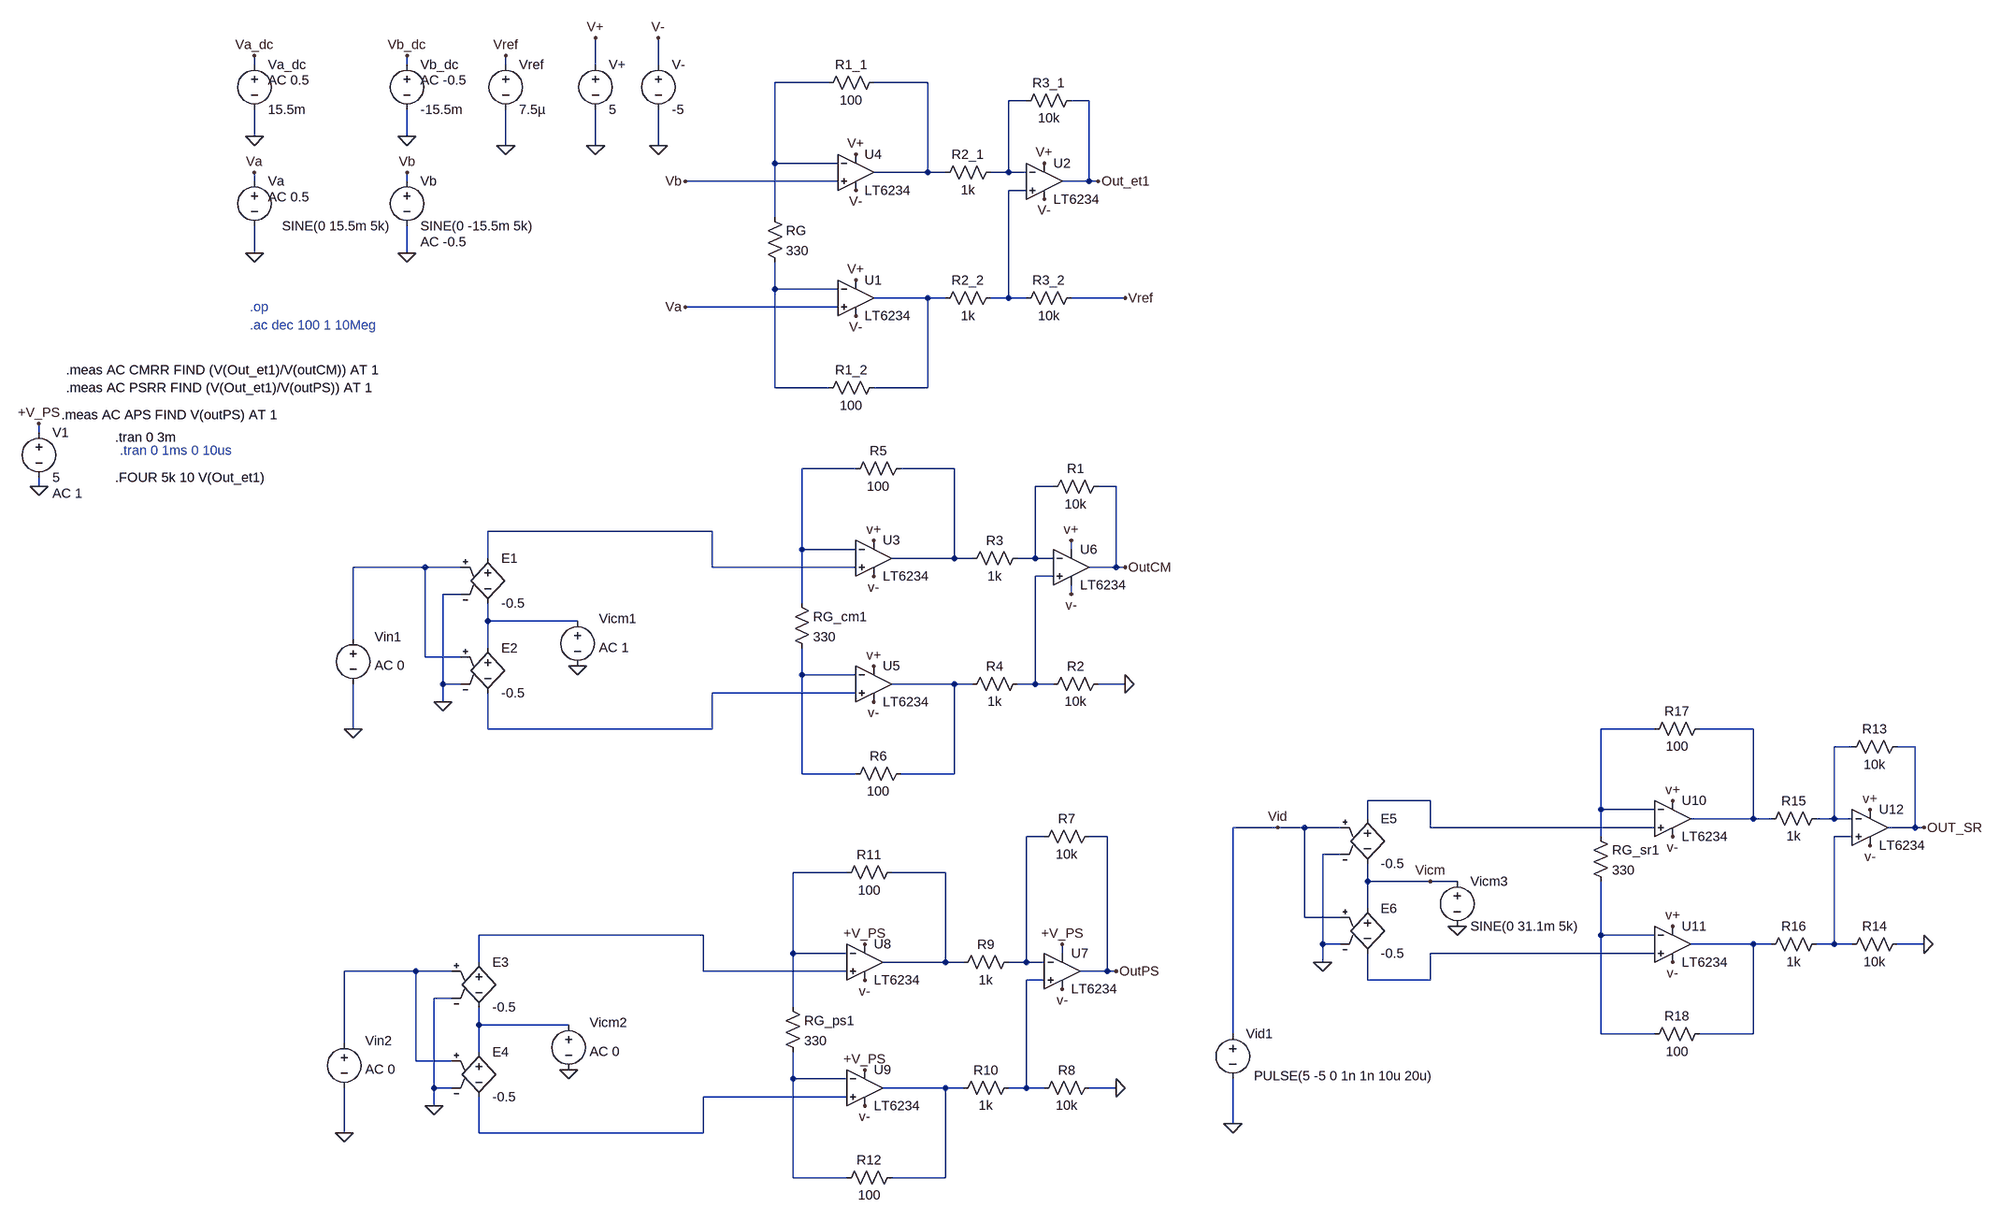
[diagram p0: schematic etaj1.asc]
etaj1.asc, the LTspice schematic file:
Version 4
SHEET 1 2128 1792
WIRE -960 -240 -960 -256
WIRE -688 -240 -688 -256
WIRE -512 -240 -512 -256
WIRE -352 -240 -352 -288
WIRE -240 -240 -240 -288
WIRE 64 -208 -32 -208
WIRE 240 -208 144 -208
WIRE 416 -176 384 -176
WIRE 528 -176 496 -176
WIRE -960 -112 -960 -160
WIRE -688 -112 -688 -160
WIRE -512 -96 -512 -160
WIRE -352 -96 -352 -160
WIRE -240 -96 -240 -160
WIRE -32 -64 -32 -208
WIRE 80 -64 -32 -64
WIRE 240 -48 240 -208
WIRE 240 -48 144 -48
WIRE 272 -48 240 -48
WIRE 384 -48 384 -176
WIRE 384 -48 352 -48
WIRE 416 -48 384 -48
WIRE -960 -32 -960 -48
WIRE -688 -32 -688 -48
WIRE 80 -32 -192 -32
WIRE 528 -32 528 -176
WIRE 528 -32 480 -32
WIRE 544 -32 528 -32
WIRE 416 -16 384 -16
WIRE -32 32 -32 -64
WIRE -960 96 -960 48
WIRE -688 96 -688 48
WIRE -32 160 -32 112
WIRE 80 160 -32 160
WIRE 240 176 144 176
WIRE 272 176 240 176
WIRE 384 176 384 -16
WIRE 384 176 352 176
WIRE 416 176 384 176
WIRE 592 176 496 176
WIRE 80 192 -192 192
WIRE -32 336 -32 160
WIRE 64 336 -32 336
WIRE 240 336 240 176
WIRE 240 336 144 336
WIRE -1344 416 -1344 400
WIRE 112 480 16 480
WIRE 288 480 192 480
WIRE -1344 512 -1344 496
WIRE 464 512 432 512
WIRE 576 512 544 512
WIRE -144 592 -544 592
WIRE 16 624 16 480
WIRE 112 624 16 624
WIRE 496 624 496 608
WIRE -544 640 -544 592
WIRE 288 640 288 480
WIRE 288 640 176 640
WIRE 320 640 288 640
WIRE 432 640 432 512
WIRE 432 640 400 640
WIRE 464 640 432 640
WIRE -656 656 -784 656
WIRE -592 656 -656 656
WIRE -144 656 -144 592
WIRE 112 656 -144 656
WIRE 576 656 576 512
WIRE 576 656 528 656
WIRE 592 656 576 656
WIRE 464 672 432 672
WIRE -592 704 -624 704
WIRE 496 704 496 688
WIRE 16 720 16 624
WIRE -544 752 -544 720
WIRE -384 752 -544 752
WIRE -784 784 -784 656
WIRE -544 800 -544 752
WIRE -656 816 -656 656
WIRE -592 816 -656 816
WIRE 16 848 16 800
WIRE 112 848 16 848
WIRE -624 864 -624 704
WIRE -592 864 -624 864
WIRE 288 864 176 864
WIRE 320 864 288 864
WIRE 432 864 432 672
WIRE 432 864 400 864
WIRE 464 864 432 864
WIRE 592 864 544 864
WIRE 112 880 -144 880
WIRE -624 896 -624 864
WIRE -784 944 -784 864
WIRE -544 944 -544 880
WIRE -144 944 -144 880
WIRE -144 944 -544 944
WIRE 1536 944 1440 944
WIRE 1712 944 1616 944
WIRE 1888 976 1856 976
WIRE 2000 976 1968 976
WIRE 16 1024 16 848
WIRE 112 1024 16 1024
WIRE 288 1024 288 864
WIRE 288 1024 192 1024
WIRE 1136 1072 1024 1072
WIRE 1440 1088 1440 944
WIRE 1536 1088 1440 1088
WIRE 1024 1104 1024 1072
WIRE 1712 1104 1712 944
WIRE 1712 1104 1600 1104
WIRE 1744 1104 1712 1104
WIRE 1856 1104 1856 976
WIRE 1856 1104 1824 1104
WIRE 1888 1104 1856 1104
WIRE 864 1120 784 1120
WIRE 912 1120 864 1120
WIRE 976 1120 912 1120
WIRE 1136 1120 1136 1072
WIRE 1536 1120 1136 1120
WIRE 2000 1120 2000 976
WIRE 2000 1120 1952 1120
WIRE 2016 1120 2000 1120
WIRE 448 1136 416 1136
WIRE 560 1136 528 1136
WIRE 1440 1136 1440 1088
WIRE 1888 1136 1856 1136
WIRE 976 1168 944 1168
WIRE 96 1200 0 1200
WIRE 272 1200 176 1200
WIRE 1024 1216 1024 1184
WIRE 1136 1216 1024 1216
WIRE 1184 1216 1136 1216
WIRE 1024 1264 1024 1216
WIRE 912 1280 912 1120
WIRE 976 1280 912 1280
WIRE -160 1312 -560 1312
WIRE 1440 1312 1440 1216
WIRE 1536 1312 1440 1312
WIRE 944 1328 944 1168
WIRE 976 1328 944 1328
WIRE 1712 1328 1600 1328
WIRE 1744 1328 1712 1328
WIRE 1856 1328 1856 1136
WIRE 1856 1328 1824 1328
WIRE 1888 1328 1856 1328
WIRE 2016 1328 1968 1328
WIRE 0 1344 0 1200
WIRE 96 1344 0 1344
WIRE 480 1344 480 1328
WIRE 1536 1344 1136 1344
WIRE -560 1360 -560 1312
WIRE 272 1360 272 1200
WIRE 272 1360 160 1360
WIRE 304 1360 272 1360
WIRE 416 1360 416 1136
WIRE 416 1360 384 1360
WIRE 448 1360 416 1360
WIRE 944 1360 944 1328
WIRE -672 1376 -800 1376
WIRE -608 1376 -672 1376
WIRE -160 1376 -160 1312
WIRE 96 1376 -160 1376
WIRE 560 1376 560 1136
WIRE 560 1376 512 1376
WIRE 576 1376 560 1376
WIRE 448 1392 416 1392
WIRE 1024 1392 1024 1344
WIRE 1136 1392 1136 1344
WIRE 1136 1392 1024 1392
WIRE -608 1424 -640 1424
WIRE 0 1440 0 1344
WIRE -560 1472 -560 1440
WIRE -400 1472 -560 1472
WIRE 784 1488 784 1120
WIRE 1440 1488 1440 1312
WIRE 1536 1488 1440 1488
WIRE 1712 1488 1712 1328
WIRE 1712 1488 1616 1488
WIRE -800 1504 -800 1376
WIRE -560 1520 -560 1472
WIRE -672 1536 -672 1376
WIRE -608 1536 -672 1536
WIRE 0 1568 0 1520
WIRE 96 1568 0 1568
WIRE -640 1584 -640 1424
WIRE -608 1584 -640 1584
WIRE 272 1584 160 1584
WIRE 304 1584 272 1584
WIRE 416 1584 416 1392
WIRE 416 1584 384 1584
WIRE 448 1584 416 1584
WIRE 576 1584 528 1584
WIRE 96 1600 -160 1600
WIRE -640 1616 -640 1584
WIRE 784 1648 784 1568
WIRE -800 1664 -800 1584
WIRE -560 1664 -560 1600
WIRE -160 1664 -160 1600
WIRE -160 1664 -560 1664
WIRE 0 1744 0 1568
WIRE 96 1744 0 1744
WIRE 272 1744 272 1584
WIRE 272 1744 176 1744
FLAG 544 -32 Out_et1
FLAG -352 -96 0
FLAG -240 -96 0
FLAG -352 -288 V+
FLAG -240 -288 V-
FLAG 112 -80 V+
FLAG 112 208 V-
FLAG 112 -16 V-
FLAG 112 144 V+
FLAG 448 0 V-
FLAG 448 -64 V+
FLAG -960 -112 0
FLAG -960 96 0
FLAG -688 -112 0
FLAG -688 96 0
FLAG -960 -256 Va_dc
FLAG -960 -48 Va
FLAG -688 -256 Vb_dc
FLAG -688 -48 Vb
FLAG -512 -96 0
FLAG -512 -256 Vref
FLAG 592 176 Vref
FLAG -192 -32 Vb
FLAG -192 192 Va
FLAG 592 864 0
FLAG 592 656 OutCM
FLAG 496 608 v+
FLAG 496 704 v-
FLAG -784 944 0
FLAG -624 896 0
FLAG -384 832 0
FLAG 576 1584 0
FLAG 576 1376 OutPS
FLAG -800 1664 0
FLAG -640 1616 0
FLAG -400 1552 0
FLAG 480 1328 +V_PS
FLAG 144 608 v+
FLAG 144 672 v-
FLAG 144 896 v-
FLAG 144 832 v+
FLAG 128 1616 v-
FLAG 480 1408 v-
FLAG 128 1392 v-
FLAG 128 1328 +V_PS
FLAG 128 1552 +V_PS
FLAG 2016 1328 0
FLAG 2016 1120 OUT_SR
FLAG 784 1648 0
FLAG 944 1360 0
FLAG 1184 1296 0
FLAG 864 1120 Vid
FLAG 1136 1216 Vicm
FLAG 1568 1072 v+
FLAG 1568 1136 v-
FLAG 1568 1296 v+
FLAG 1568 1360 v-
FLAG 1920 1088 v+
FLAG 1920 1152 v-
FLAG -1344 512 0
FLAG -1344 400 +V_PS
SYMBOL res 512 -192 R90
WINDOW 0 0 56 VBottom 2
WINDOW 3 32 56 VTop 2
SYMATTR InstName R3_1
SYMATTR Value 10k
SYMATTR SpiceLine tol=1 pwr=0.1
SYMBOL res 512 160 R90
WINDOW 0 0 56 VBottom 2
WINDOW 3 32 56 VTop 2
SYMATTR InstName R3_2
SYMATTR Value 10k
SYMATTR SpiceLine tol=1 pwr=0.1
SYMBOL res 368 -64 R90
WINDOW 0 0 56 VBottom 2
WINDOW 3 32 56 VTop 2
SYMATTR InstName R2_1
SYMATTR Value 1k
SYMATTR SpiceLine tol=1 pwr=0.1
SYMBOL res 368 160 R90
WINDOW 0 0 56 VBottom 2
WINDOW 3 32 56 VTop 2
SYMATTR InstName R2_2
SYMATTR Value 1k
SYMATTR SpiceLine tol=1 pwr=0.1
SYMBOL res -48 16 R0
SYMATTR InstName RG
SYMATTR Value 330
SYMATTR SpiceLine tol=1 pwr=0.1
SYMBOL res 160 -224 R90
WINDOW 0 0 56 VBottom 2
WINDOW 3 32 56 VTop 2
SYMATTR InstName R1_1
SYMATTR Value 100
SYMATTR SpiceLine tol=1 pwr=0.1
SYMBOL res 160 320 R90
WINDOW 0 0 56 VBottom 2
WINDOW 3 32 56 VTop 2
SYMATTR InstName R1_2
SYMATTR Value 100
SYMATTR SpiceLine tol=1 pwr=0.1
SYMBOL OpAmps\\LT6234 112 -48 R0
SYMATTR InstName U4
SYMBOL OpAmps\\LT6234 112 176 R0
SYMATTR InstName U1
SYMBOL OpAmps\\LT6234 448 -32 R0
SYMATTR InstName U2
SYMBOL voltage -352 -256 R0
SYMATTR InstName V+
SYMATTR Value 5
SYMBOL voltage -240 -256 R0
WINDOW 123 0 0 Left 0
WINDOW 39 0 0 Left 0
SYMATTR InstName V-
SYMATTR Value -5
SYMBOL voltage -688 -48 R0
WINDOW 123 24 124 Left 2
WINDOW 39 0 0 Left 0
SYMATTR Value2 AC -0.5
SYMATTR InstName Vb
SYMATTR Value SINE(0 -15.5m 5k)
SYMBOL voltage -688 -256 R0
WINDOW 123 24 44 Left 2
WINDOW 39 0 0 Left 0
SYMATTR Value2 AC -0.5
SYMATTR InstName Vb_dc
SYMATTR Value -15.5m
SYMBOL voltage -960 -48 R0
WINDOW 3 241 96 Right 2
WINDOW 123 24 44 Left 2
WINDOW 39 0 0 Left 0
SYMATTR Value SINE(0 15.5m 5k)
SYMATTR Value2 AC 0.5
SYMATTR InstName Va
SYMBOL voltage -960 -256 R0
WINDOW 123 24 44 Left 2
WINDOW 39 0 0 Left 0
SYMATTR Value2 AC 0.5
SYMATTR InstName Va_dc
SYMATTR Value 15.5m
SYMBOL voltage -512 -256 R0
WINDOW 123 0 0 Left 0
WINDOW 39 0 0 Left 0
SYMATTR InstName Vref
SYMATTR Value 7.5µ
SYMBOL res 560 496 R90
WINDOW 0 0 56 VBottom 2
WINDOW 3 32 56 VTop 2
SYMATTR InstName R1
SYMATTR Value 10k
SYMATTR SpiceLine tol=1 pwr=0.1
SYMBOL res 560 848 R90
WINDOW 0 0 56 VBottom 2
WINDOW 3 32 56 VTop 2
SYMATTR InstName R2
SYMATTR Value 10k
SYMATTR SpiceLine tol=1 pwr=0.1
SYMBOL res 416 624 R90
WINDOW 0 0 56 VBottom 2
WINDOW 3 32 56 VTop 2
SYMATTR InstName R3
SYMATTR Value 1k
SYMATTR SpiceLine tol=1 pwr=0.1
SYMBOL res 416 848 R90
WINDOW 0 0 56 VBottom 2
WINDOW 3 32 56 VTop 2
SYMATTR InstName R4
SYMATTR Value 1k
SYMATTR SpiceLine tol=1 pwr=0.1
SYMBOL res 0 704 R0
SYMATTR InstName RG_cm1
SYMATTR Value 330
SYMATTR SpiceLine tol=1 pwr=0.1
SYMBOL res 208 464 R90
WINDOW 0 0 56 VBottom 2
WINDOW 3 32 56 VTop 2
SYMATTR InstName R5
SYMATTR Value 100
SYMATTR SpiceLine tol=1 pwr=0.1
SYMBOL res 208 1008 R90
WINDOW 0 0 56 VBottom 2
WINDOW 3 32 56 VTop 2
SYMATTR InstName R6
SYMATTR Value 100
SYMATTR SpiceLine tol=1 pwr=0.1
SYMBOL voltage -784 768 R0
WINDOW 123 38 63 Left 2
WINDOW 39 0 0 Left 2
WINDOW 0 38 12 Left 2
WINDOW 3 38 40 Left 2
SYMATTR Value2 AC 0
SYMATTR InstName Vin1
SYMATTR Value ""
SYMBOL e -544 624 R0
SYMATTR InstName E1
SYMATTR Value -0.5
SYMBOL e -544 784 R0
SYMATTR InstName E2
SYMATTR Value -0.5
SYMBOL voltage -384 736 R0
WINDOW 123 38 63 Left 2
WINDOW 39 0 0 Left 2
WINDOW 0 38 12 Left 2
WINDOW 3 -188 38 Left 2
SYMATTR Value2 AC 1
SYMATTR InstName Vicm1
SYMATTR Value ""
SYMBOL res 544 1120 R90
WINDOW 0 0 56 VBottom 2
WINDOW 3 32 56 VTop 2
SYMATTR InstName R7
SYMATTR Value 10k
SYMATTR SpiceLine tol=1 pwr=0.1
SYMBOL res 544 1568 R90
WINDOW 0 0 56 VBottom 2
WINDOW 3 32 56 VTop 2
SYMATTR InstName R8
SYMATTR Value 10k
SYMATTR SpiceLine tol=1 pwr=0.1
SYMBOL res 400 1344 R90
WINDOW 0 0 56 VBottom 2
WINDOW 3 32 56 VTop 2
SYMATTR InstName R9
SYMATTR Value 1k
SYMATTR SpiceLine tol=1 pwr=0.1
SYMBOL res 400 1568 R90
WINDOW 0 0 56 VBottom 2
WINDOW 3 32 56 VTop 2
SYMATTR InstName R10
SYMATTR Value 1k
SYMATTR SpiceLine tol=1 pwr=0.1
SYMBOL res -16 1424 R0
SYMATTR InstName RG_ps1
SYMATTR Value 330
SYMATTR SpiceLine tol=1 pwr=0.1
SYMBOL res 192 1184 R90
WINDOW 0 0 56 VBottom 2
WINDOW 3 32 56 VTop 2
SYMATTR InstName R11
SYMATTR Value 100
SYMATTR SpiceLine tol=1 pwr=0.1
SYMBOL res 192 1728 R90
WINDOW 0 0 56 VBottom 2
WINDOW 3 32 56 VTop 2
SYMATTR InstName R12
SYMATTR Value 100
SYMATTR SpiceLine tol=1 pwr=0.1
SYMBOL voltage -800 1488 R0
WINDOW 123 38 63 Left 2
WINDOW 39 0 0 Left 2
WINDOW 0 38 12 Left 2
WINDOW 3 38 40 Left 2
SYMATTR Value2 AC 0
SYMATTR InstName Vin2
SYMATTR Value ""
SYMBOL e -560 1344 R0
SYMATTR InstName E3
SYMATTR Value -0.5
SYMBOL e -560 1504 R0
SYMATTR InstName E4
SYMATTR Value -0.5
SYMBOL voltage -400 1456 R0
WINDOW 123 38 63 Left 2
WINDOW 39 0 0 Left 2
WINDOW 0 38 12 Left 2
WINDOW 3 -188 38 Left 2
SYMATTR Value2 AC 0
SYMATTR InstName Vicm2
SYMATTR Value ""
SYMBOL OpAmps\\LT6234 144 640 R0
SYMATTR InstName U3
SYMBOL OpAmps\\LT6234 144 864 R0
SYMATTR InstName U5
SYMBOL OpAmps\\LT6234 496 656 R0
SYMATTR InstName U6
SYMBOL OpAmps\\LT6234 480 1376 R0
SYMATTR InstName U7
SYMBOL OpAmps\\LT6234 128 1360 R0
SYMATTR InstName U8
SYMBOL OpAmps\\LT6234 128 1584 R0
SYMATTR InstName U9
SYMBOL res 1984 960 R90
WINDOW 0 0 56 VBottom 2
WINDOW 3 32 56 VTop 2
SYMATTR InstName R13
SYMATTR Value 10k
SYMATTR SpiceLine tol=1 pwr=0.1
SYMBOL res 1984 1312 R90
WINDOW 0 0 56 VBottom 2
WINDOW 3 32 56 VTop 2
SYMATTR InstName R14
SYMATTR Value 10k
SYMATTR SpiceLine tol=1 pwr=0.1
SYMBOL res 1840 1088 R90
WINDOW 0 0 56 VBottom 2
WINDOW 3 32 56 VTop 2
SYMATTR InstName R15
SYMATTR Value 1k
SYMATTR SpiceLine tol=1 pwr=0.1
SYMBOL res 1840 1312 R90
WINDOW 0 0 56 VBottom 2
WINDOW 3 32 56 VTop 2
SYMATTR InstName R16
SYMATTR Value 1k
SYMATTR SpiceLine tol=1 pwr=0.1
SYMBOL res 1424 1120 R0
SYMATTR InstName RG_sr1
SYMATTR Value 330
SYMATTR SpiceLine tol=1 pwr=0.1
SYMBOL res 1632 928 R90
WINDOW 0 0 56 VBottom 2
WINDOW 3 32 56 VTop 2
SYMATTR InstName R17
SYMATTR Value 100
SYMATTR SpiceLine tol=1 pwr=0.1
SYMBOL res 1632 1472 R90
WINDOW 0 0 56 VBottom 2
WINDOW 3 32 56 VTop 2
SYMATTR InstName R18
SYMATTR Value 100
SYMATTR SpiceLine tol=1 pwr=0.1
SYMBOL e 1024 1088 R0
SYMATTR InstName E5
SYMATTR Value -0.5
SYMBOL e 1024 1248 R0
SYMATTR InstName E6
SYMATTR Value -0.5
SYMBOL voltage 1184 1200 R0
WINDOW 123 0 0 Left 0
WINDOW 39 0 0 Left 0
SYMATTR InstName Vicm3
SYMATTR Value SINE(0 31.1m 5k)
SYMBOL voltage 784 1472 R0
WINDOW 123 0 0 Left 2
WINDOW 39 0 0 Left 2
WINDOW 3 38 91 Left 2
SYMATTR Value PULSE(5 -5 0 1n 1n 10u 20u)
SYMATTR InstName Vid1
SYMBOL OpAmps\\LT6234 1568 1104 R0
SYMATTR InstName U10
SYMBOL OpAmps\\LT6234 1568 1328 R0
SYMATTR InstName U11
SYMBOL OpAmps\\LT6234 1920 1120 R0
SYMATTR InstName U12
SYMBOL voltage -1344 400 R0
WINDOW 123 24 124 Left 2
WINDOW 39 0 0 Left 2
SYMATTR Value2 AC 1
SYMATTR InstName V1
SYMATTR Value 5
TEXT -968 192 Left 2 ;.op
TEXT -968 224 Left 2 ;.ac dec 100 1 10Meg
TEXT -1296 304 Left 2 !.meas AC CMRR FIND (V(Out_et1)/V(outCM)) AT 1
TEXT -1296 336 Left 2 !.meas AC PSRR FIND (V(Out_et1)/V(outPS)) AT 1
TEXT -1304 384 Left 2 !.meas AC APS FIND V(outPS) AT 1
TEXT -1208 424 Left 2 !.tran 0 3m
TEXT -1200 448 Left 2 ;.tran 0 1ms 0 10us
TEXT -1208 496 Left 2 !.FOUR 5k 10 V(Out_et1)

The netlist it stands for:
* etaj1.asc
R3_1 Out_et1 N003 10k tol=1 pwr=0.1
R3_2 Vref N004 10k tol=1 pwr=0.1
R2_1 N003 N002 1k tol=1 pwr=0.1
R2_2 N004 N006 1k tol=1 pwr=0.1
RG N001 N005 330 tol=1 pwr=0.1
R1_1 N002 N001 100 tol=1 pwr=0.1
R1_2 N006 N005 100 tol=1 pwr=0.1
* U4: LT6234 (symbol OpAmps\LT6234 not available, pins judged from their places): In+=Vb In-=N001 V+=V+ V-=V- OUT=N002
* U1: LT6234 (symbol OpAmps\LT6234 not available, pins judged from their places): In+=Va In-=N005 V+=V+ V-=V- OUT=N006
* U2: LT6234 (symbol OpAmps\LT6234 not available, pins judged from their places): In+=N004 In-=N003 V+=V+ V-=V- OUT=Out_et1
V+ V+ 0 5
V- V- 0 -5
Vb Vb 0 SINE(0 -15.5m 5k) AC -0.5
Vb_dc Vb_dc 0 -15.5m AC -0.5
Va Va 0 SINE(0 15.5m 5k) AC 0.5
Va_dc Va_dc 0 15.5m AC 0.5
Vref Vref 0 7.5µ
R1 OutCM N009 10k tol=1 pwr=0.1
R2 0 N012 10k tol=1 pwr=0.1
R3 N009 N008 1k tol=1 pwr=0.1
R4 N012 N015 1k tol=1 pwr=0.1
RG_cm1 N007 N014 330 tol=1 pwr=0.1
R5 N008 N007 100 tol=1 pwr=0.1
R6 N015 N014 100 tol=1 pwr=0.1
Vin1 N011 0 AC 0
E1 N010 N013 N011 0 -0.5
E2 N013 N016 N011 0 -0.5
Vicm1 N013 0 AC 1
R7 OutPS N021 10k tol=1 pwr=0.1
R8 0 N030 10k tol=1 pwr=0.1
R9 N021 N024 1k tol=1 pwr=0.1
R10 N030 N033 1k tol=1 pwr=0.1
RG_ps1 N023 N032 330 tol=1 pwr=0.1
R11 N024 N023 100 tol=1 pwr=0.1
R12 N033 N032 100 tol=1 pwr=0.1
Vin2 N029 0 AC 0
E3 N025 N031 N029 0 -0.5
E4 N031 N034 N029 0 -0.5
Vicm2 N031 0 AC 0
* U3: LT6234 (symbol OpAmps\LT6234 not available, pins judged from their places): In+=N010 In-=N007 V+=V+ V-=V- OUT=N008
* U5: LT6234 (symbol OpAmps\LT6234 not available, pins judged from their places): In+=N016 In-=N014 V+=V+ V-=V- OUT=N015
* U6: LT6234 (symbol OpAmps\LT6234 not available, pins judged from their places): In+=N012 In-=N009 V+=V+ V-=V- OUT=OutCM
* U7: LT6234 (symbol OpAmps\LT6234 not available, pins judged from their places): In+=N030 In-=N021 V+=+V_PS V-=V- OUT=OutPS
* U8: LT6234 (symbol OpAmps\LT6234 not available, pins judged from their places): In+=N025 In-=N023 V+=+V_PS V-=V- OUT=N024
* U9: LT6234 (symbol OpAmps\LT6234 not available, pins judged from their places): In+=N034 In-=N032 V+=+V_PS V-=V- OUT=N033
R13 OUT_SR N019 10k tol=1 pwr=0.1
R14 0 N022 10k tol=1 pwr=0.1
R15 N019 N018 1k tol=1 pwr=0.1
R16 N022 N027 1k tol=1 pwr=0.1
RG_sr1 N017 N026 330 tol=1 pwr=0.1
R17 N018 N017 100 tol=1 pwr=0.1
R18 N027 N026 100 tol=1 pwr=0.1
E5 N020 Vicm Vid 0 -0.5
E6 Vicm N028 Vid 0 -0.5
Vicm3 Vicm 0 SINE(0 31.1m 5k)
Vid1 Vid 0 PULSE(5 -5 0 1n 1n 10u 20u)
* U10: LT6234 (symbol OpAmps\LT6234 not available, pins judged from their places): In+=N020 In-=N017 V+=V+ V-=V- OUT=N018
* U11: LT6234 (symbol OpAmps\LT6234 not available, pins judged from their places): In+=N028 In-=N026 V+=V+ V-=V- OUT=N027
* U12: LT6234 (symbol OpAmps\LT6234 not available, pins judged from their places): In+=N022 In-=N019 V+=V+ V-=V- OUT=OUT_SR
V1 +V_PS 0 5 AC 1
* .op
* .ac dec 100 1 10Meg
.meas AC CMRR FIND (V(Out_et1)/V(outCM)) AT 1
.meas AC PSRR FIND (V(Out_et1)/V(outPS)) AT 1
.meas AC APS FIND V(outPS) AT 1
.tran 0 3m
* .tran 0 1ms 0 10us
.FOUR 5k 10 V(Out_et1)
.backanno
.end